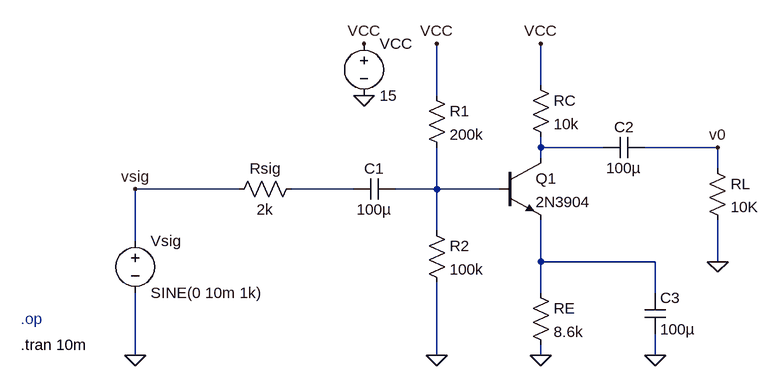
[diagram p0: schematic hw2_112021117_c.asc]
hw2_112021117_c.asc, the LTspice schematic file:
Version 4.1
SHEET 1 928 680
WIRE 560 -80 560 -144
WIRE 400 -64 400 -144
WIRE 560 16 560 0
WIRE 656 16 560 16
WIRE 832 16 720 16
WIRE 560 32 560 16
WIRE 832 48 832 16
WIRE 96 80 -64 80
WIRE 272 80 176 80
WIRE 400 80 400 16
WIRE 400 80 336 80
WIRE 496 80 400 80
WIRE 400 144 400 80
WIRE -64 160 -64 80
WIRE 560 192 560 128
WIRE 736 192 560 192
WIRE 832 192 832 128
WIRE 560 240 560 192
WIRE 736 240 736 192
WIRE -64 336 -64 240
WIRE 400 336 400 224
WIRE 560 336 560 320
WIRE 736 336 736 304
FLAG -64 336 0
FLAG 400 336 0
FLAG 560 336 0
FLAG 736 336 0
FLAG 288 -64 0
FLAG 560 -144 VCC
FLAG 400 -144 VCC
FLAG 288 -144 VCC
FLAG 832 16 v0
FLAG 832 192 0
FLAG -64 80 vsig
SYMBOL voltage -64 144 R0
WINDOW 123 0 0 Left 0
WINDOW 39 0 0 Left 0
SYMATTR InstName Vsig
SYMATTR Value SINE(0 10m 1k)
SYMBOL res 192 64 R90
WINDOW 0 0 56 VBottom 2
WINDOW 3 32 56 VTop 2
SYMATTR InstName Rsig
SYMATTR Value 2k
SYMBOL cap 336 64 R90
WINDOW 0 0 32 VBottom 2
WINDOW 3 32 32 VTop 2
SYMATTR InstName C1
SYMATTR Value 100µ
SYMBOL res 384 -80 R0
SYMATTR InstName R1
SYMATTR Value 200k
SYMBOL res 384 128 R0
SYMATTR InstName R2
SYMATTR Value 100k
SYMBOL npn 496 32 R0
SYMATTR InstName Q1
SYMATTR Value 2N3904
SYMBOL res 544 -96 R0
SYMATTR InstName RC
SYMATTR Value 10k
SYMBOL res 544 224 R0
SYMATTR InstName RE
SYMATTR Value 8.6k
SYMBOL cap 720 304 M180
WINDOW 0 24 56 Left 2
WINDOW 3 24 8 Left 2
SYMATTR InstName C3
SYMATTR Value 100µ
SYMBOL cap 720 0 R90
WINDOW 0 0 32 VBottom 2
WINDOW 3 32 32 VTop 2
SYMATTR InstName C2
SYMATTR Value 100µ
SYMBOL res 816 32 R0
SYMATTR InstName RL
SYMATTR Value 10K
SYMBOL voltage 288 -160 R0
SYMATTR InstName VCC
SYMATTR Value 15
TEXT -240 320 Left 2 !.tran 10m
TEXT -240 280 Left 2 ;.op

The netlist it stands for:
* hw2_112021117_c.asc
Vsig vsig 0 SINE(0 10m 1k)
Rsig N002 vsig 2k
C1 N003 N002 100µ
R1 VCC N003 200k
R2 N003 0 100k
Q1 N001 N003 N004 0 2N3904
RC VCC N001 10k
RE N004 0 8.6k
C3 0 N004 100µ
C2 v0 N001 100µ
RL v0 0 10K
VCC VCC 0 15
.model NPN NPN
.model PNP PNP
.lib standard.bjt
.tran 10m
* .op
.backanno
.end